# Altium schematic sheet 01_KAAI3020_TestBoard.SchDoc
size 420 x 297 mm; DocumentNumber: 1; SheetNumber: 1; SheetTotal: 2; Title1: Title1; PageSetup: Record=PageOptions|CenterHorizontal=True|CenterVertical=True|PrintScale=0.66|XCorrection=1.00|YCorrection=1.00|PrintKind=0|BorderSize=5000000|LeftOffset=0|BottomOffset=0|Orientation=2|PaperLength=1000|PaperWidth=1000|Scale=100|PaperSource=15|PrintQuality=600|MediaType=1|DitherType=10|PrintScaleMode=1|PaperKind=A4|PaperIndex=9
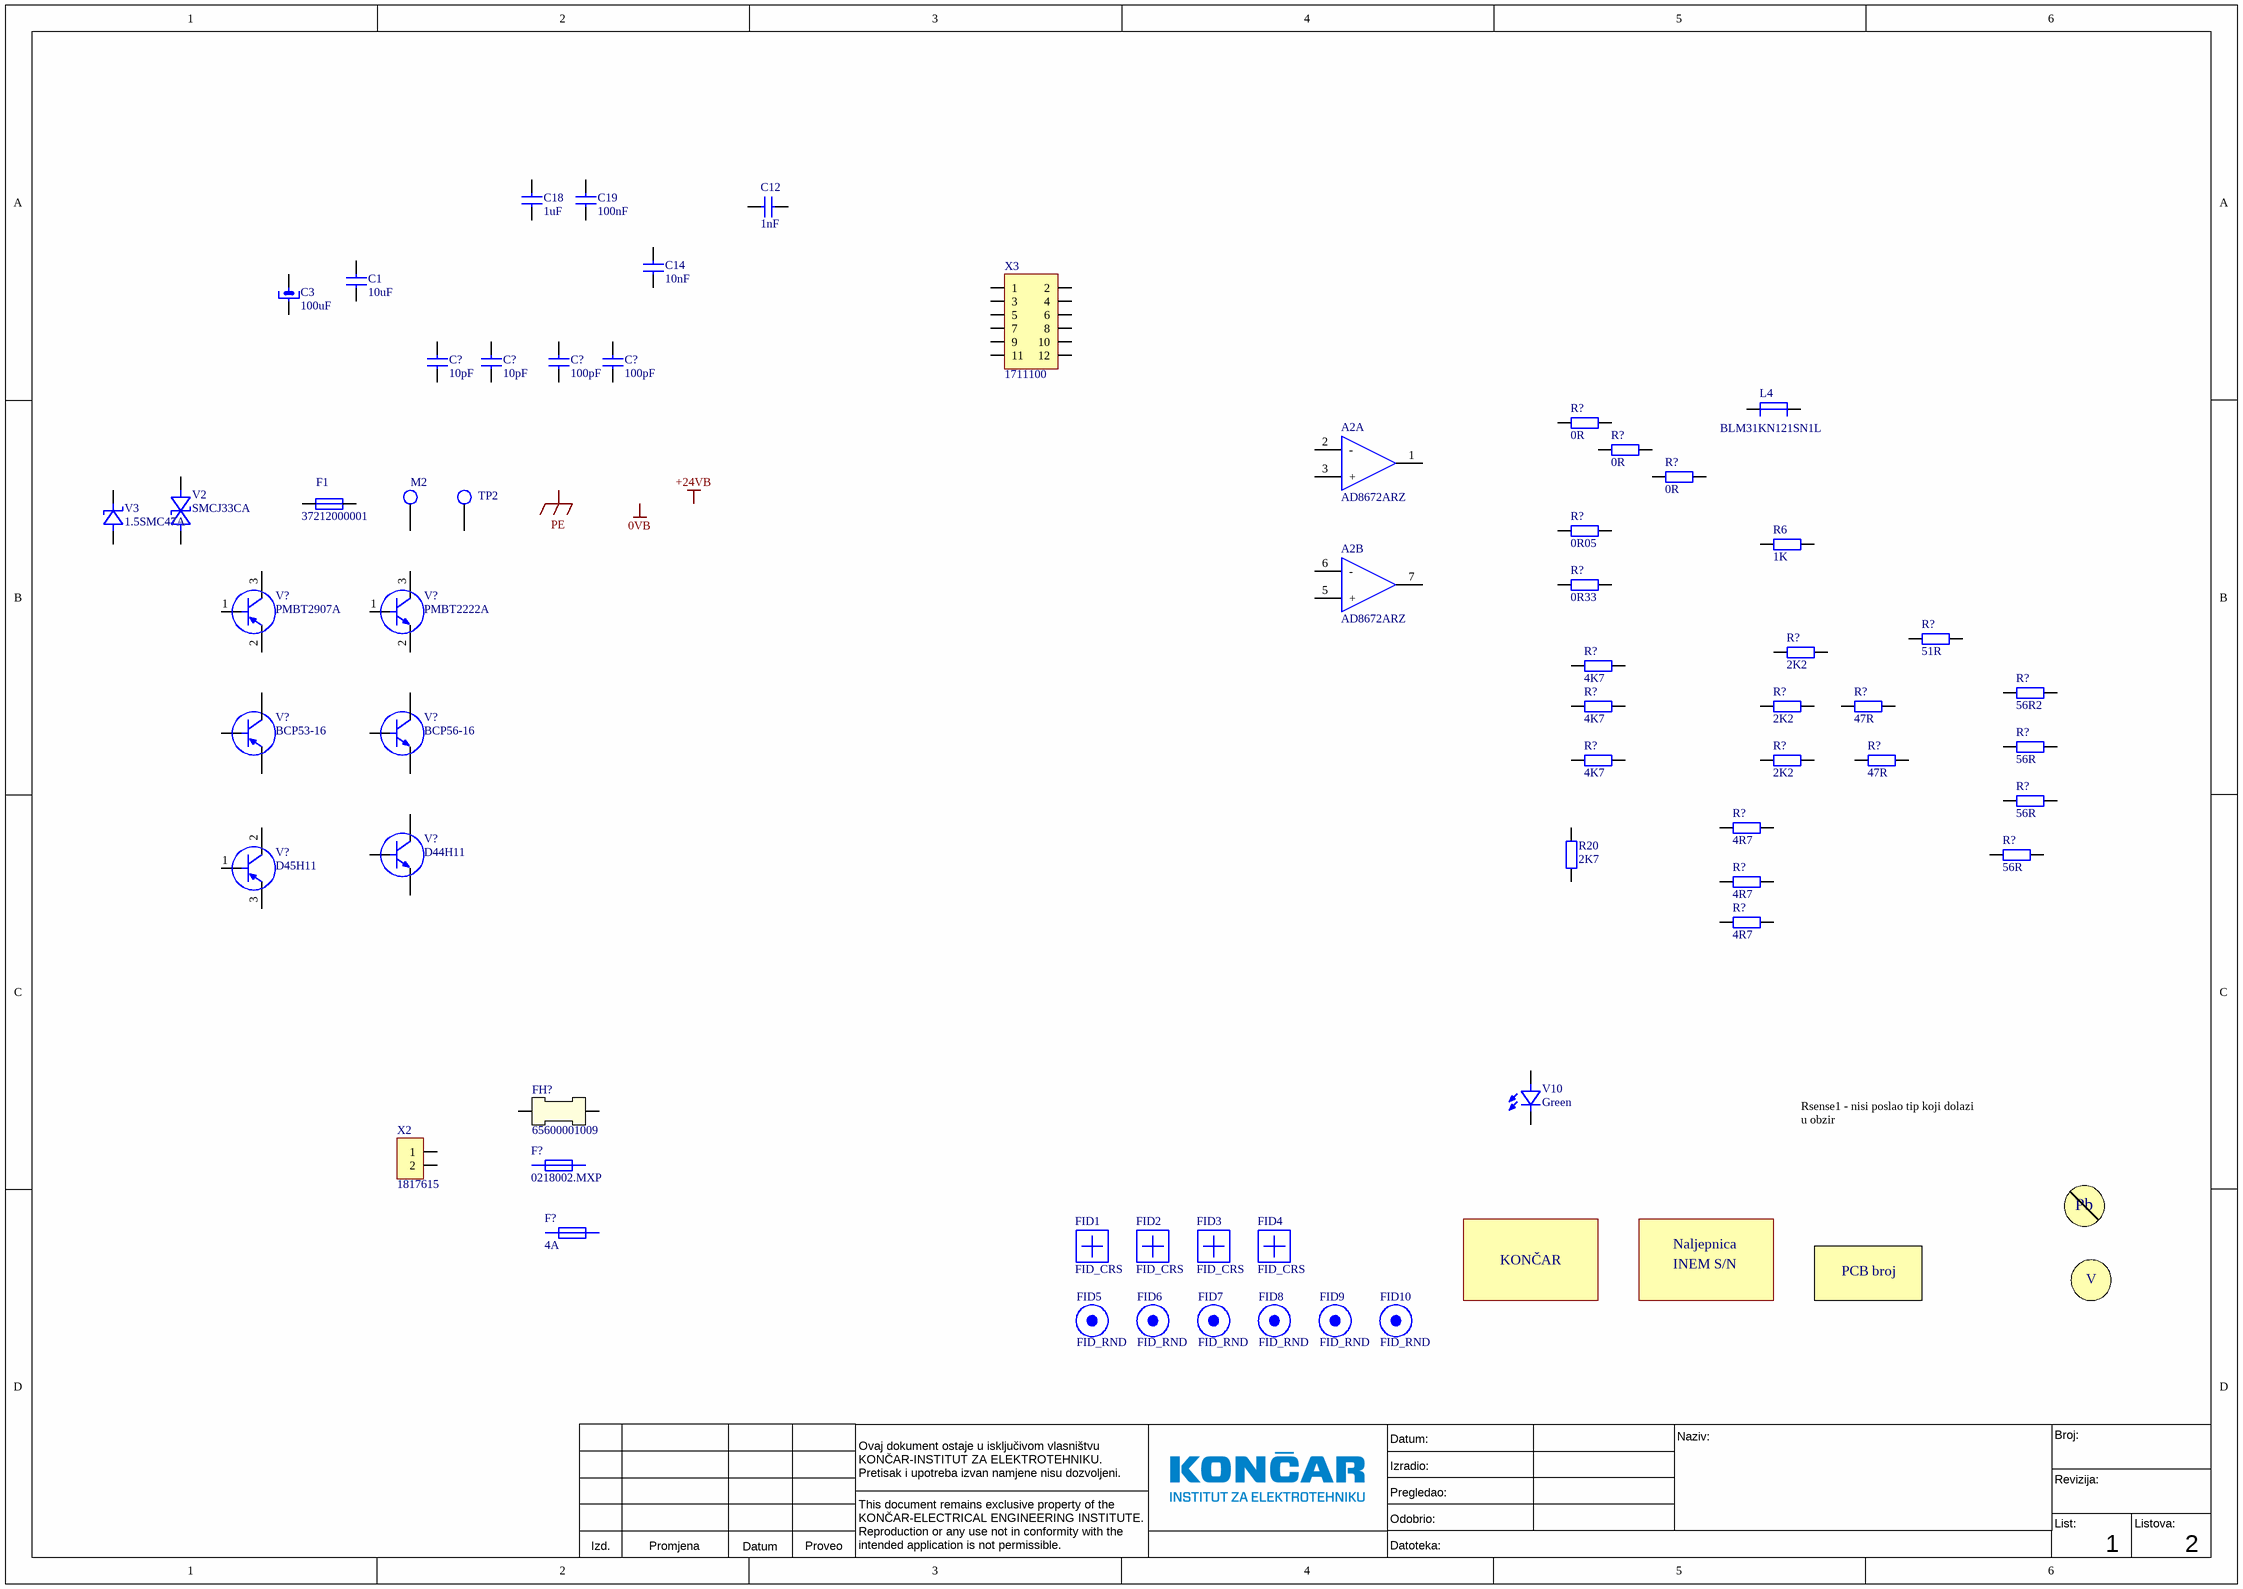
[diagram p0: 01_KAAI3020_TestBoard.SchDoc]

## Parts
(Parts that share a designator on the sheet are numbered #1, #2 ... from top to bottom, then left to right.)
A2  AD8672ARZ  [SOIC127P600X175-8M]  (parts A,B of 3)
C1  value 10uF  [CAPC3225X28M]  (hidden comment: CAP_10uF_1210_10%)
C3  value 100uF  [CAPPRD500W60D1000H1200A]  (hidden comment: ELC_100uF_50V_20%)
C12  value 1nF  [CAPC1608X09M]  (hidden comment: CAP_1nF_0603_10%)
C14  value 10nF  [CAPC1608X09M]  (hidden comment: CAP_10nF_0603_10%)
C18  value 1uF  [CAPC2012X09M]  (hidden comment: CAP_1uF_0805_10%)
C19  value 100nF  [CAPC1608X09M]  (hidden comment: CAP_100nF_0603_10%)
C?#1  value 10pF  [CAPC1608X09M]  (hidden comment: CAP_10pF_0603_5%)
C?#2  value 10pF  [CAPC2012X09M]  (hidden comment: CAP_10pF_0805_5%)
C?#3  value 100pF  [CAPC1608X09M]  (hidden comment: CAP_100pF_0603_5%)
C?#4  value 100pF  [CAPC2012X09M]  (hidden comment: CAP_100pF_0805_5%)
F1  value 37212000001  [FUSE_3721200001]  (hidden comment: F_2A_250V)
F?#1  value 0218002.MXP  [Littelfuse_04450001H]  (hidden comment: Littelfuse_0218002.MXP)  (mechanical)
F?#2  value 4A  [Littelfuse_04450001H]  (hidden comment: Littelfuse_0218004.MXP)  (mechanical)
FH?  65600001009  [65600001009]
FID1  FID_CRS  [FID_CRS]  (no BOM)
FID2  FID_CRS  [FID_CRS]  (no BOM)
FID3  FID_CRS  [FID_CRS]  (no BOM)
FID4  FID_CRS  [FID_CRS]  (no BOM)
FID5  FID_RND  [FID_RND]  (no BOM)
FID6  FID_RND  [FID_RND]  (no BOM)
FID7  FID_RND  [FID_RND]  (no BOM)
FID8  FID_RND  [FID_RND]  (no BOM)
FID9  FID_RND  [FID_RND]  (no BOM)
FID10  FID_RND  [FID_RND]  (no BOM)
L4  BLM31KN121SN1L  [INDC3216X18N]
Logo1  KONČAR  [KONČAR]  (value not drawn)  (no BOM)
Logo2  PCB_broj  [PCB_broj]  (value not drawn)  (no BOM)
M2  101506.28 BZ  [TPCW320D140H190P]  (value not drawn)
MP5  Znak_vizualna_kontrola_INEM  [Znak_INEM_vizualna_kontrola]  (value not drawn)  (no BOM)
MP?  Oznaka_PbFree  [Oznaka_PbFree]  (value not drawn)  (no BOM)
Nalj1  Naljepnica_TestingNo_INEM  [Naljepnica_INEM_TestingNo]  (value not drawn)  (no BOM)
R6  value 1K  [RESC2112X05M]  (hidden comment: RES_1K_0805_1%)
R20  value 2K7  [RESC3116X06M]  (hidden comment: RES_2K7_1206_1%)
R?#1  value 0R  [RESC2112X05M]  (hidden comment: RES_0R_0805_1%)
R?#2  value 0R  [RESC3116X06M]  (hidden comment: RES_0R_1206_1%)
R?#3  value 0R  [RESC6331X07M]  (hidden comment: RES_0R_2512_1%)
R?#4  value 0R05  [RESC6432X09M]  (hidden comment: RES_0R05_2512_1%)
R?#5  value 0R33  [RESD3300W110L2540D880]  (hidden comment: RES_0R33_5W_5%)
R?#6  value 51R  [RESC6432X07M]  (hidden comment: R_51R_2512_1%)
R?#7  value 2K2  [RESC2112X05M]  (hidden comment: RES_2K2_0805_1%)
R?#8  value 4K7  [RESC3116X06M]  (hidden comment: RES_4K7_1206_1%)
R?#9  value 56R2  [RESC6331X07M]  (hidden comment: RES_56R2_2512_1%)
R?#10  value 4K7  [RESC2112X05M]  (hidden comment: RES_4K7_0805_1%)
R?#11  value 2K2  [RESC6331X07M]  (hidden comment: RES_2K2_2512_1%)
R?#12  value 47R  [RESC2112X05M]  (hidden comment: RES_47R_0805_1%)
R?#13  value 56R  [RESC3116X06M]  (hidden comment: RES_56R_1206_1%)
R?#14  value 4K7  [RESC6331X07M]  (hidden comment: RES_4K7_2512_1%)
R?#15  value 2K2  [RESC3116X06M]  (hidden comment: RES_2K2_1206_1%)
R?#16  value 47R  [RESC3116X06M]  (hidden comment: RES_47R_1206_1%)
R?#17  value 56R  [RESC6331X07M]  (hidden comment: RES_56R_2512_1%)
R?#18  value 4R7  [RESC3116X06M]  (hidden comment: RES_4R7_1206_1%)
R?#19  value 56R  [RESC2112X05M]  (hidden comment: RES_56R_0805_1%)
R?#20  value 4R7  [RESC2112X05M]  (hidden comment: RES_4R7_0805_1%)
R?#21  value 4R7  [RESMELF5822M]  (hidden comment: MELFR_4R7_0207_1%)
TP2  TP1  [Test pad 1mm]  (value not drawn)  (no BOM)
V2  SMCJ33CA  [DIOM6959X26N]
V3  1.5SMC47A  [DIOM6959X26M]
V10  value Green  [LEDC2013X11M-green]  (hidden comment: LED_0805_Green)
V?#1  PMBT2907A  [SOT95P230X110-3M]
V?#2  PMBT2222A  [SOT95P230X110-3M]
V?#3  BCP53-16  [SOT230P700X170-4M]
V?#4  BCP56-16  [SOT230P700X180-4M]
V?#5  D44H11  [TO-220A]
V?#6  D45H11  [TO-220A]
X2  1817615  [PhoenixContact_1817615]
X3  value 1711100  [PhoenixContact_1711100]  (hidden comment: PhoenixContact_1711100)

## Nets
NetV?#3_2: V?#3.2(C) V?#3.4(C)
NetV?#4_2: V?#4.2(C) V?#4.4(C)

Not connected (* = marked no-connect by the designer): A2 1(Out1) 2(-) 3(+) 5(+) 6(-) 7(Out2); C1 1 2; C3 1 2; C12 1 2; C14 1 2; C18 1 2; C19 1 2; C?#1 1 2; C?#2 1 2; C?#3 1 2; C?#4 1 2; F1 1 2; FH? 1 2; L4 1 2; M2 1; R6 1 2; R20 1 2; R?#1 1 2; R?#2 1 2; R?#3 1 2; R?#4 1 2; R?#5 1 2; R?#6 1 2; R?#7 1 2; R?#8 1 2; R?#9 1 2; R?#10 1 2; R?#11 1 2; R?#12 1 2; R?#13 1 2; R?#14 1 2; R?#15 1 2; R?#16 1 2; R?#17 1 2; R?#18 1 2; R?#19 1 2; R?#20 1 2; R?#21 1 2; TP2 1; V2 1 2; V3 1 2; V10 1 2; V?#1 1(B) 2(E) 3(C); V?#2 1(B) 2(E) 3(C); V?#3 1(B) 3(E); V?#4 1(B) 3(E); V?#5 1(B) 2(C) 3(E); V?#6 1(B) 2(C) 3(E); X2 1 2; X3 1 2 3 4 5 6 7 8 9 10 11 12

## Notes on the sheet
- Rsense1 - nisi poslao tip koji dolazi u obzir
- Labels drawn without touching a wire or pin: 0VB, +24VB, PE
- Datum:
- Izradio:
- Naziv:
- Broj:
- Ovaj dokument ostaje u isključivom vlasništvu KONČAR-INSTITUT ZA ELEKTROTEHNIKU. Pretisak i upotreba izvan namjene nisu dozvoljeni.
- Pregledao:
- Odobrio:
- Revizija:
- List:
- Listova:
- Izd.
- Promjena
- Datum
- Proveo
- This document remains exclusive property of the KONČAR-ELECTRICAL ENGINEERING INSTITUTE. Reproduction or any use not in conformity with the intended application is not permissible.
- Datoteka:
- (in symbol CMP-0554-0D) V
- (in symbol CMP-0558-0D) Naljepnica; INEM S/N
- (in symbol CMP-1836-0A) Pb

## Library data of the parts
A2 = CMP-0151-0D: Operational Amplifier, Dual, Precision Low Noise, Low Input Bias Current, 10MHz, 4V/µs, ±5V to ±15V; Manufacturer: Analog Devices; OperatingTemp: -40 to 125; HelpURL: \\srv-perun\Repos\Comp\090_COTS\Components\Datasheets\Analog_integrated\Analog_Devices\AD8671_8672_8674.pdf; MountingType: SMD; ManufacturerPartNumber: AD8672ARZ; PackageType: SOIC-8; DatasheetVersion: Rev. F; PartStatus: Active; Value: AD8672ARZ; ValueNumeric: AD8672ARZ
C1 = CMP-0234-0D: Capacitor, Ceramic, Multilayer, X7R, 10uF, 50V, 10%, AVX; ManufacturerPartNumber: 12105C106KAT2A; ValueNumeric: 10000000; DatasheetVersion: REV 02; Height: 2.79mm; HelpURL: \\srv-perun\Repos\Comp\090_COTS\Components\Datasheets\Capacitors\AVX\X7RDielectric.pdf; Manufacturer: AVX; MountingType: SMD; OperatingTemp: -55ºC to +125ºC; PackageType: 1210; PartStatus: Active; ROHS: Yes; Tolerance: 10%; Voltage: 50V
C3 = CMP-0818-0B: Capacitor, Electrolytic, Aluminum, 100uF, 20%, 50V, Low ESR, Long-Life 10000h@105C, Vishay; ManufacturerPartNumber: MAL213661101E3; ValueNumeric: 100000000; Manufacturer: Vishay; HelpURL: \\srv-perun\Repos\Comp\090_COTS\Components\Datasheets\Capacitors\Vishay\136rvi-101620.pdf; MountingType: THT; DatasheetVersion: 16-Sep-16; Tolerance: 20%; Height: 12mm; ROHS: Yes; PartStatus: Active; PackageType: Radial 10x12mm; OperatingTemp: -55°C to +105℃; Voltage: 50V
C12 = CMP-0248-0D: Capacitor, Ceramic, Multilayer, X7R, 1nF, 10%, 50V, Kemet; ManufacturerPartNumber: C0603C102K5RACTU; ValueNumeric: 1000; MountingType: SMD; ROHS: Yes; Tolerance: 10%; Voltage: 50V; HelpURL: \\srv-perun\Repos\Comp\090_COTS\Components\Datasheets\Capacitors\Kemet\KEM_C1002_X7R_SMD.pdf; PackageType: 1608 metric (0603 EIA); PartStatus: Active; OperatingTemp: -55°C to 125°C; Manufacturer: Kemet; DatasheetVersion: 2/29/2016
C14 = CMP-0251-0D: Capacitor, Ceramic, Multilayer, X7R, 10nF, 10%, 50V, Kemet; ManufacturerPartNumber: C0603C103K5RACTU; ValueNumeric: 10000; HelpURL: \\srv-perun\Repos\Comp\090_COTS\Components\Datasheets\Capacitors\Kemet\KEM_C1002_X7R_SMD.pdf; MountingType: SMD; OperatingTemp: -55°C to 125°C; Tolerance: 10%; PackageType: 1608 metric (0603 EIA); ROHS: Yes; DatasheetVersion: 2/29/2016; Voltage: 50V; Manufacturer: Kemet; PartStatus: Active
C18 = CMP-1248-0A: Capacitor, Ceramic, Multilayer, X7R, 1uF, 10%, 50V, Yageo; ManufacturerPartNumber: CC0805KKX7R9BB105; ValueNumeric: 1000000; HelpURL: \\SRV-PERUN\Repos\Comp\090_COTS\Components\Datasheets\Capacitors\Yageo\UPY-GPHC_X7R_6.3V-to-50V_13.pdf; PartStatus: Active; Voltage: 50V; ROHS: Yes; PackageType: 0805 (2012 metric); Height: 1.25mm; Manufacturer: Yageo; OperatingTemp: -55C to +125C; MountingType: SMD; DatasheetVersion: December 30, 2015 V.13; Tolerance: 10%
C19 = CMP-0255-0E: Capacitor, Ceramic, Multilayer, X7R, 100nF, 10%, 50V, Yageo; ManufacturerPartNumber: CC0603KRX7R9BB104; ValueNumeric: 100000; DatasheetVersion: December 30, 2015 V.13; Manufacturer: Yageo; MountingType: SMD; OperatingTemp: -55°C to 125°C; PackageType: 1608 metric (0603 EIA); PartStatus: Active; ROHS: Yes; Tolerance: 10%; Voltage: 50V; HelpURL: \\srv-perun\Repos\Comp\090_COTS\Components\Datasheets\Capacitors\Yageo\UPY-GPHC_X7R_6.3V-to-50V_13.pdf
C?#1 = CMP-0243-0E: Capacitor, Ceramic, Multilayer, C0G (N0P), 10pF, 5%, 50V, COG (NPO), Kemet; ManufacturerPartNumber: C0603C100J5GACTU; ValueNumeric: 10; Manufacturer: Kemet; PackageType: 1608 metric (0603 EIA); DatasheetVersion: 3/30/2016; Tolerance: 5%; OperatingTemp: -55°C to 125°C; MountingType: SMD; HelpURL: \\srv-perun\Repos\Comp\090_COTS\Components\Datasheets\Capacitors\Kemet\KEM_C1003_C0G_SMD.pdf; Voltage: 50V; ROHS: Yes; PartStatus: Active
C?#2 = CMP-0041-0H: Capacitor, Ceramic, Multilayer, C0G (NP0), 10pF, 5%, 50V, AVX; ManufacturerPartNumber: 08055A100JAT; ValueNumeric: 10; PartStatus: Active; PackageType: 0805; Manufacturer: AVX; OperatingTemp: -55°C to 125°C; ROHS: Yes; HelpURL: \\srv-perun\Repos\Comp\090_COTS\Components\Datasheets\Capacitors\AVX\C0GNP0-Dielectric.pdf; MountingType: SMD; Tolerance: 5%; Voltage: 50V
C?#3 = CMP-1644-0A: Capacitor, Ceramic, Multilayer, C0G (N0P), 100pF, 5%, 100V, Kemet; ManufacturerPartNumber: C0603C101J1GAC7411; Tolerance: 10%; ValueNumeric: 100; OperatingTemp: -55C to +125C; PartStatus: Active; Voltage: 100V; PackageType: 0603 (1608 metric); MountingType: SMD; DatasheetVersion: 3/30/2016; Manufacturer: Kemet; Height: 0.9mm; HelpURL: \\srv-perun\Repos\Comp\090_COTS\Components\Datasheets\Capacitors\Kemet\KEM_C1003_C0G_SMD.pdf; ROHS: Yes
C?#4 = CMP-0102-0G: Capacitor, Ceramic, Multilayer, C0G (NP0), 100pF, 5%, 50V, AVX; ManufacturerPartNumber: 08055A101JAT; ValueNumeric: 100; PartStatus: Active; ROHS: Yes; MountingType: SMD; Manufacturer: AVX; HelpURL: \\srv-perun\Repos\Comp\090_COTS\Components\Datasheets\Capacitors\AVX\C0GNP0-Dielectric.pdf; PackageType: 0805; OperatingTemp: -55°C to 125°C; Voltage: 50V; Tolerance: 5%
F1 = CMP-0238-0J: Fuse, 2A, 250V, 0.6W, TR5 Time Lag, 372 series; Manufacturer: Littelfuse; DatasheetVersion: Revised: 01/06/16; Height: 8mm; HelpURL: \\srv-perun\Repos\Comp\090_COTS\Components\Datasheets\Resistors\Littelfuse\Littelfuse_Fuse_372_Datasheet.pdf; MountingType: THT; OperatingTemp: -40ºC to +85ºC; PartStatus: Active; Power: 0.6W; ROHS: Yes; ValueNumeric: 37212000001; Voltage: 250V; ManufacturerPartNumber: 37212000001
F?#1 = CMP-0584-0C: Fuse - Cartridge, 2A, Time-lag, 5x20mm , Glass Body, 218 Series; Voltage: 250V; ROHS: Yes; ManufacturerPartNumber: 0218002.MXP; HelpURL: \\SRV-PERUN\Repos\Comp\090_COTS\Components\Datasheets\Resistors\Littelfuse\Littelfuse_Fuse_218_Datasheet.pdf; Height: 8mm; MountingType: THT; ValueNumeric: 0218002.MXP; Manufacturer: Littelfuse; OperatingTemp: –55ºC to +125ºC; DatasheetVersion: Revised: 06/06/16; PartStatus: Active
F?#2 = CMP-0697-0C: Fuse - Cartridge, 4 A, Time-lag, 5x20mm , Glass Body, 218 Series; ValueNumeric: 4; Voltage: 250V; Height: 8mm; OperatingTemp: –55ºC to +125ºC; Manufacturer: Littelfuse; MountingType: THT; ManufacturerPartNumber: 0218 004.MXP; HelpURL: \\SRV-PERUN\Repos\Comp\090_COTS\Components\Datasheets\Resistors\Littelfuse\Littelfuse_Fuse_218_Datasheet.pdf-310015.pdf; PartStatus: Active; DatasheetVersion: Revised: 06/06/16; ROHS: Yes
FH? = CMP-0593-0L: Fuse Holder, For 5x20mm Fuses, 656 Series, Littelfuse; Voltage: 250V; Power: 4W/2.5W (w_o/w cover); Height: 12.7mm; Manufacturer: Littelfuse; ManufacturerPartNumber: 65600001009; PackageType: THT; HelpURL: \\SRV-PERUN\Repos\Comp\090_COTS\Components\Datasheets\Mechanical\Littelfuse\Littelfuse_Fuse_Block_656_Datasheet.pdf; OperatingTemp: -40ºC to +85ºC; DatasheetVersion: Revised: 06/03/15; MountingType: THT; ROHS: Yes; PartStatus: Active; Value: 65600001009; ValueNumeric: 65600001009
FID1-FID4 = CMP-0290-0J: Fiducial, Cross, W=4mm, H=4mm; Manufacturer: KONČAR; ManufacturerPartNumber: FID_CRS; MountingType: SMD; PartStatus: Active; Value: FID_CRS; ValueNumeric: FID_CRS
FID5-FID10 = CMP-0288-0A: Fiducial, Round, D=4mm (inner D=1mm); Manufacturer: KONČAR; ManufacturerPartNumber: FID_RND; MountingType: SMD; PartStatus: Active; Value: FID_RND; ValueNumeric: FID_RND
L4 = CMP-1537-0B: Ferrite Bead, EMI Suppression Filter, 6A, Murata; Tolerance: 25%; BrDijela: E41906; Value: BLM31KN121SN1L; ManufacturerPartNumber: BLM31KN121SN1L; HelpURL: \\srv-perun\Repos\Comp\090_COTS\Components\Datasheets\Inductors_and_Transformers\Murata\BLM31KN121SN1#.pdf; PackageType: 1206 (3216 matric); DatasheetVersion: 03/19/2021; PartStatus: Active; ValueNumeric: BLM31KN121SN1L; MountingType: SMD; Height: 1.8mm; OperatingTemp: -55C to +125C; ROHS: Yes; Manufacturer: Murata
Logo1 = CMP-0268-0E: PCB logo; OperatingTemp: Active; PartStatus: Active; Value: logo; ValueNumeric: KONČAR; Manufacturer: KONČAR; ManufacturerPartNumber: KONČAR
Logo2 = CMP-1543-0B: PCB broj; ManufacturerPartNumber: .K_PcbNum; Manufacturer: KONČAR; OperatingTemp: Active; Value: PCB broj; PartStatus: Active; ValueNumeric: KONČAR
M2 = CMP-0308-0E: Solder lug for PCB, Closed, 2.8x7.5x0.6mm; Manufacturer: Vogt Ag; ROHS: Yes; Value: 2.8x7.5x0.6mm; ValueNumeric: 2.8x7.5x0.6mm; Height: 4mm; HelpURL: http://goo.gl/hPcdM9; ManufacturerPartNumber: 101506.28 BZ; MountingType: THT; PartStatus: Active
MP5 = CMP-0554-0D: Znak, Vizualna kontrola, INEM; ManufacturerPartNumber: Znak_krug; Manufacturer: KONCAR INEM; ValueNumeric: Krug; Value: Krug; PartStatus: Active
MP? = CMP-1836-0A: Oznaka, Pb Free; Manufacturer: KONČAR; Value: Pb Free; PartStatus: Active; ManufacturerPartNumber: Pb Free; ValueNumeric: Pb Free
Nalj1 = CMP-0558-0D: Naljepnica, serijski broj testiranje, INEM, 25x8mm; Manufacturer: KONCAR INEM; ManufacturerPartNumber: NaljepnicaTestingNo; ValueNumeric: 25x8mm; Value: 25x8mm; PartStatus: Active
R6 = CMP-0028-0H: Resistor, Thick Film, 1K, 1%, 0.125W, TK100, Vishay; ManufacturerPartNumber: CRCW08051K00FKEA; ValueNumeric: 1000; ROHS: Yes; Manufacturer: Vishay; PackageType: 0805; Tolerance: 1%; DatasheetVersion: Revision: 04-Jun-12; MountingType: SMD; Power: 0.125W; Height: 0.5mm; PartStatus: Active; HelpURL: \\srv-perun\Repos\Comp\090_COTS\Components\Datasheets\Resistors\Vishay\dcrcwe3.pdf; OperatingTemp: - 55C to +155C
R20 = CMP-1168-0A: Resistor, Thick Film, 2K7, 1%, 0.25W, TK100, Vishay; ManufacturerPartNumber: CRCW12062K70FKEA; ValueNumeric: 2700; Voltage: 200V; PackageType: 1206 (3216 metric); Tolerance: 1%; DatasheetVersion: Revision: 04-Jun-12; PartStatus: Active; MountingType: SMD; Power: 0.25W; Height: 0.6mm; OperatingTemp: -55C to +155C; Manufacturer: Vishay; ROHS: Yes; HelpURL: \\srv-perun\Repos\Comp\090_COTS\Components\Datasheets\Resistors\Vishay\dcrcwe3.pdf
R?#1 = CMP-0000-0I: Resistor, Thick Film, 0R, 1%, 0.125W, TK100, Vishay; ManufacturerPartNumber: CRCW08050000Z; ValueNumeric: 0; Manufacturer: Vishay; Tolerance: 1%; DatasheetVersion: Revision: 04-Jun-12; HelpURL: \\srv-perun\Repos\Comp\090_COTS\Components\Datasheets\Resistors\Vishay\dcrcwe3.pdf; MountingType: SMD; PackageType: 0805; Height: 0.5mm; OperatingTemp: - 55C to +155C; Power: 0.125W; ROHS: Yes; PartStatus: Active
R?#2 = CMP-1307-0A: Resistor, Thick Film, 0R, 1%, 0.25W, Vishay; ManufacturerPartNumber: CRCW12060000Z0EA; ValueNumeric: 0; Voltage: 200V; Height: 0.6mm; Tolerance: 1%; DatasheetVersion: Revision: 04-Jun-12; Manufacturer: Vishay; ROHS: Yes; Power: 0.25W; HelpURL: \\srv-perun\Repos\Comp\090_COTS\Components\Datasheets\Resistors\Vishay\dcrcwe3.pdf; OperatingTemp: -55C to +155C; PackageType: 1206 (3216 metric); MountingType: SMD; PartStatus: Active
R?#3 = CMP-0454-0E: Resistor, Thick Film, 0R, 1%, 1W, TK100, Vishay; ManufacturerPartNumber: CRCW25120000Z0EG; Voltage: 500V; ValueNumeric: 0; Tolerance: 1%; ROHS: Yes; HelpURL: \\srv-perun\Repos\Comp\090_COTS\Components\Datasheets\Resistors\Vishay\dcrcwe3.pdf; Height: 0.7mm; DatasheetVersion: Revision: 04-Jun-12; PartStatus: Active; MountingType: SMD; Manufacturer: Vishay; OperatingTemp: -55C to +155C; Power: 1W; PackageType: 2512 (6332 metric)
R?#4 = CMP-0195-0E: Resistor, Metal Strip, 0R05, 1%, 1W, TK75, Vishay; ManufacturerPartNumber: WSLT2512R0500FEA; ValueNumeric: 0.05; Voltage: 500V; PackageType: 2512 (6332 metric); Power: 1W; OperatingTemp: -65C to +275C; Tolerance: 1%; ROHS: Yes; Manufacturer: Vishay; PartStatus: Active; MountingType: SMD; HelpURL: \\srv-perun\Repos\Comp\090_COTS\Components\Datasheets\Resistors\Vishay\wslt2512.pdf; Height: 0.9mm; DatasheetVersion: Revision: 02-Oct-12
R?#5 = CMP-0580-0B: Resistor, 0R33, TK90, 5W, 5%, Axial, CW005 Series; ManufacturerPartNumber: CW005R3300JB12; Manufacturer: Vishay; ValueNumeric: 0.33; ROHS: Yes; PartStatus: Active; Power: 5W; Tolerance: ±5%; DatasheetVersion: Revision: 20-Oct-16; HelpURL: \\SRV-PERUN\Repos\Comp\090_COTS\Components\Datasheets\Resistors\Vishay\cw.pdf; OperatingTemp: -65°C to +250°C; Height: 8.8mm; MountingType: THT
R?#6 = CMP-0738-0C: Resistor, Thick Film, 51R, 1%, 1W, TK100, Panasonic; ManufacturerPartNumber: ERJ-U1TF51R0; ValueNumeric: 51; Voltage: 200V; OperatingTemp: -55C to +155C; Tolerance: 1%; ROHS: Yes; HelpURL: \\srv-perun\Repos\Comp\090_COTS\Components\Datasheets\Resistors\Panasonic\AOA0000C334.pdf; PartStatus: Active; Height: 0.7mm; PackageType: 2512 (6332 metric); DatasheetVersion: Nov. 2017; Power: 1W; Manufacturer: Panasonic; MountingType: SMD
R?#7 = CMP-0035-0H: Resistor, Thick Film, 2K2, 1%, 0.125W, TK100, Vishay; ManufacturerPartNumber: CRCW08052K20FKEA; ValueNumeric: 2200; DatasheetVersion: Revision: 04-Jun-12; OperatingTemp: - 55C to +155C; Manufacturer: Vishay; ROHS: Yes; HelpURL: \\srv-perun\Repos\Comp\090_COTS\Components\Datasheets\Resistors\Vishay\dcrcwe3.pdf; PackageType: 0805; MountingType: SMD; PartStatus: Active; Power: 0.125W; Tolerance: 1%; Height: 0.5mm
R?#8 = CMP-0443-0E: Resistor, Thick Film, 4K7, 1%, 0.25W, TK100, Vishay; ManufacturerPartNumber: CRCW12064K70FK; Voltage: 200V; OperatingTemp: -55C to +155C; Height: 0.6mm; PartStatus: Active; MountingType: SMD; HelpURL: \\srv-perun\Repos\Comp\090_COTS\Components\Datasheets\Resistors\Vishay\dcrcwe3.pdf; DatasheetVersion: Revision: 04-Jun-12; Tolerance: 1%; Power: 0.25W; ROHS: Yes; ValueNumeric: 4K7; Manufacturer: Vishay; PackageType: 1206 (3216 metric)
R?#9 = CMP-0572-0B: Resistor, Thick Film, 56R2, 1%, 1W, TK100, Vishay; ManufacturerPartNumber: CRCW251256R2FKEG; Voltage: 500V; ValueNumeric: 56.2; Power: 1W; MountingType: SMD; Height: 0.7mm; DatasheetVersion: Revision: 04-Jun-12; OperatingTemp: - 55°C to +155°C; HelpURL: \\srv-perun\Repos\Comp\090_COTS\Components\Datasheets\Resistors\Vishay\dcrcwe3.pdf; Tolerance: 1%; Manufacturer: Vishay; PartStatus: Active; PackageType: 2512
R?#10 = CMP-0039-0H: Resistor, Thick Film, 4K7, 1%, 0.125W, TK100, Vishay; ManufacturerPartNumber: CRCW08054K70FKEA; ValueNumeric: 4700; Tolerance: 1%; Power: 0.125W; Height: 0.5mm; MountingType: SMD; HelpURL: \\srv-perun\Repos\Comp\090_COTS\Components\Datasheets\Resistors\Vishay\dcrcwe3.pdf; Manufacturer: Vishay; DatasheetVersion: Revision: 04-Jun-12; OperatingTemp: - 55C to +155C; ROHS: Yes; PartStatus: Active; PackageType: 0805
R?#11 = CMP-0441-0D: Resistor, Thick Film, 2K2, 1%, 1W, TK100, Vishay; ManufacturerPartNumber: CRCW25122K20FKEG; Voltage: 500V; ValueNumeric: 2200; MountingType: SMD; Power: 1W; Manufacturer: Vishay; OperatingTemp: -55C to +155C; Height: 0.7mm; Tolerance: 1%; PartStatus: Active; HelpURL: \\srv-perun\Repos\Comp\090_COTS\Components\Datasheets\Resistors\Vishay\dcrcwe3.pdf; PackageType: 2512 (6332 metric); DatasheetVersion: Revision: 04-Jun-12; ROHS: Yes
R?#12 = CMP-0009-0I: Resistor, Thick Film, 47R, 1%, 0.125W, TK100, Vishay; ManufacturerPartNumber: CRCW080547R0FKEA; ValueNumeric: 47; MountingType: SMD; HelpURL: \\srv-perun\Repos\Comp\090_COTS\Components\Datasheets\Resistors\Vishay\dcrcwe3.pdf; Height: 0.5mm; PartStatus: Active; Power: 0.125W; OperatingTemp: - 55C to +155C; DatasheetVersion: Revision: 04-Jun-12; Tolerance: 1%; PackageType: 0805; ROHS: Yes; Manufacturer: Vishay
R?#13 = CMP-1087-0A: Resistor, Thick Film, 56R, 1%, 0.25W, TK100, Vishay; ManufacturerPartNumber: CRCW120656R0FKEA; ValueNumeric: 56; Voltage: 200V; PartStatus: Active; DatasheetVersion: Revision: 04-Jun-12; MountingType: SMD; OperatingTemp: -55C to +155C; Height: 0.6mm; Power: 0.25W; Manufacturer: Vishay; ROHS: Yes; PackageType: 1206 (3216 metric); HelpURL: \\srv-perun\Repos\Comp\090_COTS\Components\Datasheets\Resistors\Vishay\dcrcwe3.pdf; Tolerance: 1%
R?#14 = CMP-0442-0D: Resistor, Thick Film, 4K7, 1%, 1W, TK100, Vishay; ManufacturerPartNumber: CRCW25124K70FKEG; Voltage: 500V; ValueNumeric: 4700; Power: 1W; HelpURL: \\srv-perun\Repos\Comp\090_COTS\Components\Datasheets\Resistors\Vishay\dcrcwe3.pdf; DatasheetVersion: Revision: 04-Jun-12; Tolerance: 1%; MountingType: SMD; Height: 0.7mm; Manufacturer: Vishay; ROHS: Yes; PackageType: 2512 (6332 metric); PartStatus: Active; OperatingTemp: -55C to +155C
R?#15 = CMP-0551-0D: Resistor, Thick Film, 2K2, 1%, 0.25W, TK100, metal-film resistor; ManufacturerPartNumber: CRCW12062K20FK; Manufacturer: Vishay; Voltage: 200V; ValueNumeric: 2200; ROHS: Yes; Tolerance: 1%; Power: 0.25W; PartStatus: Active; HelpURL: \\srv-perun\Repos\Comp\090_COTS\Components\Datasheets\Resistors\Vishay\dcrcwe3.pdf; PackageType: 1206 (3216 metric); Height: 0.6mm; OperatingTemp: -55C to +155C; DatasheetVersion: Revision: 04-Jun-12; MountingType: SMD
R?#16 = CMP-1166-0A: Resistor, Thick Film, 47R, 1%, 0.25W, TK100, Vishay; ManufacturerPartNumber: CRCW120647R0FKEA; ValueNumeric: 47; Voltage: 200V; PartStatus: Active; Height: 0.6mm; Manufacturer: Vishay; Power: 0.25W; DatasheetVersion: Revision: 04-Jun-12; HelpURL: \\srv-perun\Repos\Comp\090_COTS\Components\Datasheets\Resistors\Vishay\dcrcwe3.pdf; ROHS: Yes; OperatingTemp: -55C to +155C; Tolerance: 1%; MountingType: SMD; PackageType: 1206 (3216 metric)
R?#17 = CMP-0600-0D: Resistor, Thick Film, 56R, 1%, 1W, TK100, Vishay; ManufacturerPartNumber: CRCW251256R0FKEG; ValueNumeric: 56; Voltage: 500V; Power: 1W; HelpURL: \\srv-perun\Repos\Comp\090_COTS\Components\Datasheets\Resistors\Vishay\dcrcwe3.pdf; OperatingTemp: -55C to +155C; Tolerance: 1%; PartStatus: Active; DatasheetVersion: Revision: 04-Jun-12; Height: 0.7mm; ROHS: Yes; MountingType: SMD; Manufacturer: Vishay; PackageType: 2512 (6332 metric)
R?#18 = CMP-1368-0A: Resistor, Thick Film, 4R7, 1%, 0.25W, TK100, Vishay; ManufacturerPartNumber: CRCW12064R70FKEA; Voltage: 200V; ValueNumeric: 4.7; Height: 0.6mm; Manufacturer: Vishay; MountingType: SMD; DatasheetVersion: Revision: 04-Jun-12; Tolerance: 1%; ROHS: Yes; PartStatus: Active; PackageType: 1206 (3216 metric); OperatingTemp: -55C to +155C; HelpURL: \\srv-perun\Repos\Comp\090_COTS\Components\Datasheets\Resistors\Vishay\dcrcwe3.pdf; Power: 0.25W
R?#19 = CMP-0010-0I: Resistor, Thick Film, 56R, 1%, 0.125W, TK100, Vishay; ManufacturerPartNumber: CRCW080556R0FKEA; ValueNumeric: 56; PackageType: 0805; Height: 0.5mm; ROHS: Yes; Manufacturer: Vishay; Power: 0.125W; Tolerance: 1%; HelpURL: \\srv-perun\Repos\Comp\090_COTS\Components\Datasheets\Resistors\Vishay\dcrcwe3.pdf; MountingType: SMD; OperatingTemp: - 55C to +155C; DatasheetVersion: Revision: 04-Jun-12; PartStatus: Active
R?#20 = CMP-1383-0A: Resistor, Thick Film, 4R7, 1%, 0.125W, TK100, Vishay; ManufacturerPartNumber: CRCW08054R70FKEA; ValueNumeric: 4.7; OperatingTemp: - 55C to +155C; DatasheetVersion: Revision: 04-Jun-12; PartStatus: Active; Height: 0.5mm; Manufacturer: Vishay; Power: 0.125W; MountingType: SMD; Tolerance: 1%; PackageType: 0805 (2012 metric); HelpURL: \\srv-perun\Repos\Comp\090_COTS\Components\Datasheets\Resistors\Vishay\dcrcwe3.pdf; ROHS: Yes
R?#21 = CMP-1895-0A: Resistor, MELF, 4R7, 1%, 0.4W, TK50, Vishay; ManufacturerPartNumber: MMB02070C4708FB200; BrDijela: E38624; ValueNumeric: 4.7; Voltage: 200V; DatasheetVersion: Revision: 09-Feb-16; Manufacturer: Vishay; ROHS: Yes; HelpURL: \\srv-perun\Repos\Comp\090_COTS\Components\Datasheets\Resistors\Vishay\melfprof.pdf; PackageType: MMB 0207; Tolerance: 1%; MountingType: SMD; Power: 0.4W; OperatingTemp: -55C to +155C; PartStatus: Active; Height: 2.2mm
TP2 = CMP-0400-0D: Test pad, round, 1mm; Manufacturer: Končar; ManufacturerPartNumber: Test_pad_1mm; MountingType: SMD; PartStatus: Active; Value: TP1; ValueNumeric: TP1; ClassName: CH1
V2 = CMP-1479-0B: Diode, TVS , Bidirectional, 1500W, 33V, Littelfuse; Manufacturer: Littelfuse; PartStatus: Active; HelpURL: \\srv-perun\Repos\Comp\090_COTS\Components\Datasheets\Semiconductors\Littelfuse\Littelfuse_TVS_Diode_SMCJ_Datasheet.pdf; Power: 1500W; Voltage: 33V; Height: 2.62mm; MountingType: SMD; PackageType: DO-214AB; OperatingTemp: -65C to +150C; ValueNumeric: SMCJ33CA; ROHS: Yes; DatasheetVersion: Revised: BA.08/31/20; Value: SMCJ33CA; ManufacturerPartNumber: SMCJ33CA
V3 = CMP-0093-0E: TVS Diode, Unidirectional, 1500W, 47V,  TransZorb® 1.5SMC Series; Manufacturer: Vishay; DatasheetVersion: Revision: 20-Dec-13; MountingType: SMD; Power: 1500W; Value: 1.5SMC47A; OperatingTemp: -65 to 150; PackageType: DO-214AB; ManufacturerPartNumber: 1.5SMC47A; HelpURL: \\srv-perun\Repos\Comp\090_COTS\Components\Datasheets\Semiconductors\Vishay\15smcseries.pdf; PartStatus: Active; ValueNumeric: 1.5SMC47A; Voltage: 47V
V10 = CMP-0297-0A: LED, green, 20mA, 570nm; Manufacturer: Kingbright; ManufacturerPartNumber: KP-2012MGC; DatasheetVersion: REV NO: V.16; HelpURL: \\srv-perun\Repos\Comp\090_COTS\Components\Datasheets\Optoelectronic\Kingbright\1684561.pdf; MountingType: SMD; OperatingTemp: -40 to 85; PackageType: 2012 (0805 EIA); PartStatus: Active; ValueNumeric: Green
V?#1 = CMP-0564-0C: Transitor Bipolar, PNP, 60V, 0.6A, 250mW; Manufacturer: NXP; MTBF: 1.33x10E9; ValueNumeric: PMBT2907A; OperatingTemp: -65°C to +150°C; ManufacturerPartNumber: PMBT2907A; PackageType: SOT-23; PartStatus: Active; Value: PMBT2907A; ROHS: Yes; Power: 250mW; HelpURL: \\srv-perun\Repos\Comp\090_COTS\Components\Datasheets\Semiconductors\NXP\PMBT2907A.pdf; DatasheetVersion: 6 March 2015; MountingType: SMD; Height: 1.1mm; Voltage: 60V
V?#2 = CMP-0133-0G: Transitor Bipolar, NPN, 40V, 0.6A, 250mW; Manufacturer: NXP; MTBF: 1.33x10E9; MountingType: SMD; HelpURL: \\srv-perun\Repos\Comp\090_COTS\Components\Datasheets\Semiconductors\NXP\PMBT2222_PMBT2222A.pdf; PackageType: SOT-23; PartStatus: Active; ManufacturerPartNumber: PMBT2222A; Voltage: 40V; DatasheetVersion: Rev. 6 - 12 November 2010; ValueNumeric: PMBT2222A; Value: PMBT2222A; ROHS: Yes; OperatingTemp: -65°C to +150°C; Power: 250mW
V?#3 = CMP-0780-0A: Transistor, Bipolar, PNP, Low Power, 80V, 1A, Infineon; Power: 2W; Height: 1.8mm; MountingType: SMD; OperatingTemp: up to +150°C; PackageType: SOT-223; Value: BCP53-16; PartStatus: Active; Manufacturer: Infineon; DatasheetVersion: 2011-10-13; Voltage: 80V; ManufacturerPartNumber: BCP53-16; ROHS: Yes; ValueNumeric: BCP53-16; HelpURL: \\srv-perun\Repos\Comp\090_COTS\Components\Datasheets\Semiconductors\Infineon\Infineon-BCP51_BCP52_BCP53-DS-v01_01-en.pdf
V?#4 = CMP-0541-0A: Transistor, Bipolar, NPN, 80V, 1A; Manufacturer: Nexperia; MTBFstandard: 1.41x10E9; PartStatus: Active; DatasheetVersion: Rev. 9 — 25 October 2011; ManufacturerPartNumber: BCP56-16; ValueNumeric: BCP56-16; PackageType: SOT223; HelpURL: \\srv-perun\Repos\Comp\090_COTS\Components\Datasheets\Semiconductors\NXP\BCP56_BCX56_BC56PA.pdf; OperatingTemp: -55 to 150; Value: BCP56-16; MountingType: SMD
V?#5 = CMP-0821-0A: Transitor Bipolar, NPN, Power, 80V, 10A, 50W; Manufacturer: ST Microelectronics; ROHS: Yes; Height: 19mm; PackageType: TO-220A; DatasheetVersion: Doc ID 4213 Rev 5; MountingType: THT; PartStatus: Active; ManufacturerPartNumber: D44H11; Voltage: 80V; OperatingTemp: -65°C to +150°C; HelpURL: \\srv-perun\Repos\Comp\090_COTS\Components\Datasheets\Semiconductors\ST\en.CD00000942.pdf; ValueNumeric: D44H11; Power: 50W; Value: D44H11
V?#6 = CMP-0820-0D: Transistor, Bipolar, PNP, Power, -80V, 10A, 50W, ST; Manufacturer: ST Microelectronics; ManufacturerPartNumber: D45H11; MountingType: THT; PackageType: TO-220A; OperatingTemp: -65C to +150C; ROHS: Yes; DatasheetVersion: Doc ID 4213 Rev 5; PartStatus: Active; HelpURL: \\srv-perun\Repos\Comp\090_COTS\Components\Datasheets\Semiconductors\ST\en.CD00000942.pdf; ValueNumeric: D45H11; Height: 19mm; Voltage: -80V; Value: D45H11; Power: 50W
X2 = CMP-0929-0C: Connector, Header, 2 Pin, Right Angle, Pitch 3.5mm, 8A, 160V, MC 1,5/2-GF-3,5-LR; Manufacturer: Phoenix Contact; ManufacturerPartNumber: 1817615; DatasheetVersion: 10/11/2018; Value: 1817615; MountingType: THT; ValueNumeric: 1817615; PackageType: THT; Voltage: 160V; PartStatus: Active; Height: 7.25mm; OperatingTemp: -40C to +105C; HelpURL: \\SRV-PERUN\Repos\Comp\090_COTS\Components\Datasheets\Connectors\Phoenix Contact\1817615.pdf
X3 = CMP-1469-0D: Connector, Header, 2x6, Right Angle, Pitch 3.5mm, 8A, 160V, DMC 1,5/6-G1F-3,5-LR P26THR, Phoenix Contact; ValueNumeric: 1711100; Height: 10.8mm; HelpURL: \\srv-perun\Repos\Comp\090_COTS\Components\Datasheets\Connectors\Phoenix Contact\1711100.pdf; Voltage: 160V; OperatingTemp: -55C to +85C; DatasheetVersion: 03/24/2021; Manufacturer: Phoenix Contact; PartStatus: Active; ManufacturerPartNumber: 1711100; ROHS: Yes; MountingType: THT